# Altium project HITACHI_Wind.PrjPcb
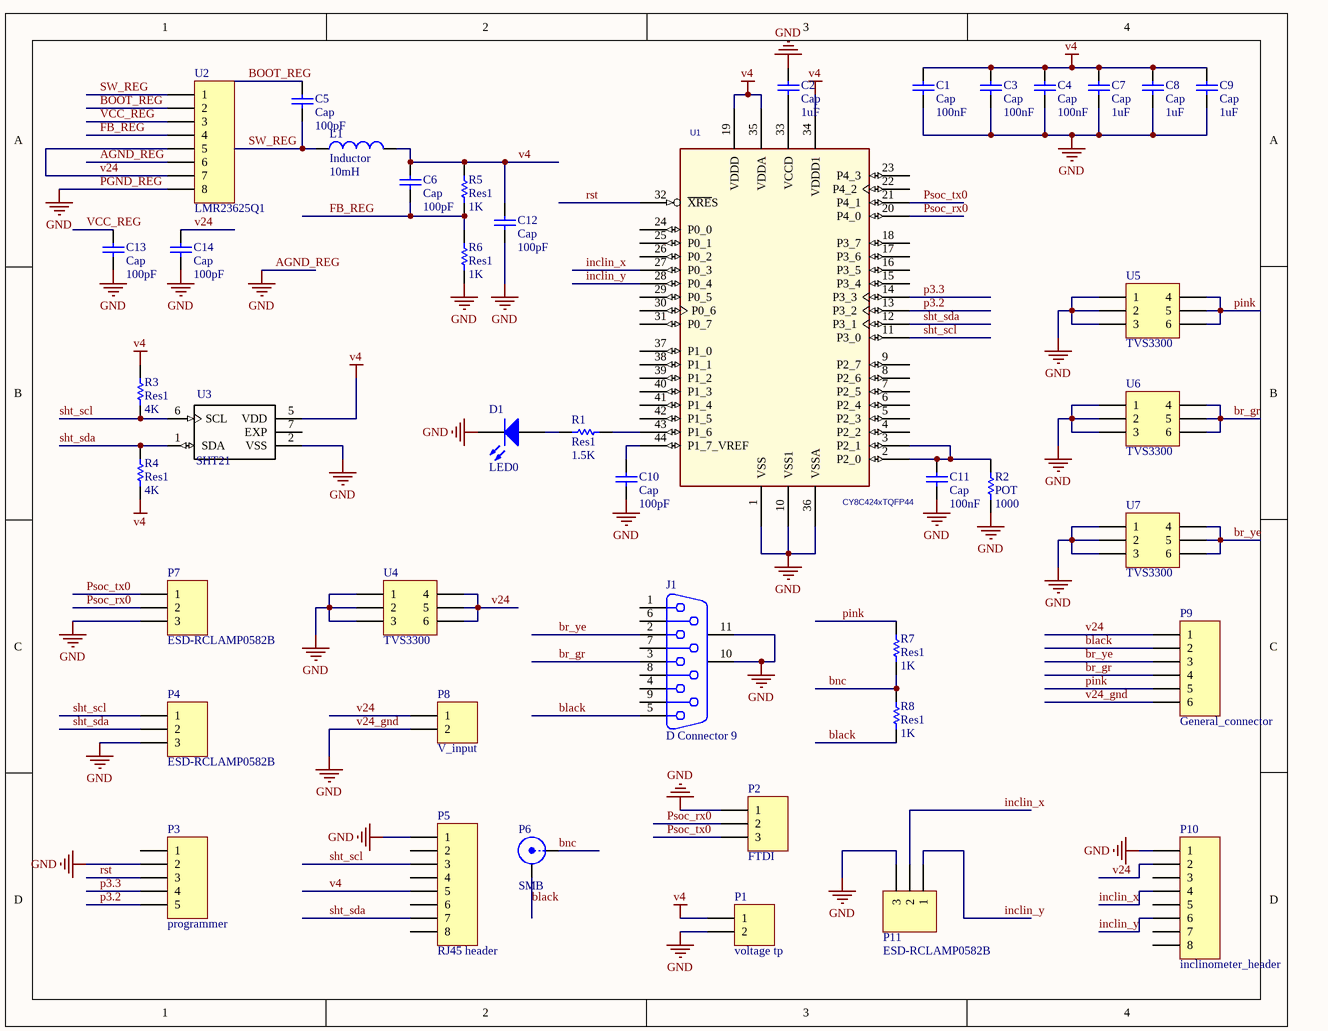
[diagram p0: Hitachi_wind_main.SchDoc]
1 sheet, 43 parts. Net scope: global (net labels, ports and power ports of the same name join across sheets).
Board file: Hitachi_wind_pcb.PcbDoc

## Sheet Hitachi_wind_main.SchDoc: AT long bus (13.3 x 4.2 inches)
size A; Organization: Organization; Address1: Address1; Address2: Address2; Address3: Address3; Address4: Address4; DocumentNumber: 1; Revision: 0; SheetNumber: 2; SheetTotal: 2

### Parts
C1  Cap  value 100nF  [1608[0603]]
C2  Cap  value 1uF  [1608[0603]]
C3  Cap  value 100nF  [1608[0603]]
C4  Cap  value 100nF  [1608[0603]]
C5  Cap  value 100pF  [1608[0603]]
C6  Cap  value 100pF  [1608[0603]]
C7  Cap  value 1uF  [1608[0603]]
C8  Cap  value 1uF  [1608[0603]]
C9  Cap  value 1uF  [1608[0603]]
C10  Cap  value 100pF  [1608[0603]]
C11  Cap  value 100nF  [1608[0603]]
C12  Cap  value 100pF  [1608[0603]]
C13  Cap  value 100pF  [1608[0603]]
C14  Cap  value 100pF  [1608[0603]]
D1  LED0  [3.2X1.6X1.1]
J1  D Connector 9  [DSUB1.385-2H9]
L1  Inductor  value 10mH  [0402-A]
P1  voltage tp  [HDR1X2]
P2  FTDI  [HDR1X3]
P3  programmer  [HDR1X5]
P4  ESD-RCLAMP0582B  [SC75]
P5  RJ45 header  [RJ-45 Header]
P6  SMB  [SMB_V-RJ45]
P7  ESD-RCLAMP0582B  [SC75]
P8  V_input  [HDR1X2]
P9  General_connector  [HDR1X6]
P10  inclinometer_header  [RJ-45 Header]
P11  ESD-RCLAMP0582B  [SC75]
R1  Res1  value 1.5K  [6-0805_M]
R2  POT  value 1000  [6-0805_M]
R3  Res1  value 4K  [6-0805_M]
R4  Res1  value 4K  [6-0805_M]
R5  Res1  value 1K  [6-0805_M]
R6  Res1  value 1K  [6-0805_M]
R7  Res1  value 1K  [6-0805_M]
R8  Res1  value 1K  [6-0805_M]
U1  CY8C424xTQFP44  [TQFP50P900X900X160-48N]
U2  LMR23625Q1  [SOIC-8]
U3  SHT21  [SON100P300X300X110-7N]
U4  TVS3300  [WSON-6_M]
U5  TVS3300  [WSON-6_M]
U6  TVS3300  [WSON-6_M]
U7  TVS3300  [WSON-6_M]

### Nets
AGND_REG: C1.1 C2.2 C3.1 C4.1 C7.1 C8.1 C9.1 C10.1 C11.1 C12.1 C13.1 C14.1 D1.2(K) J1.10(MH1) J1.11(MH2) P1.2 P2.1 P3.2 P4.3 P5.1 P7.3 P8.2 P9.6 P10.1 P11.3 R2.1 R6.1 U1.1(VSS) U1.10(VSS1) U1.36(VSSA) U2.6 U2.8 U3.2(VSS) U4.1 U4.2 U4.3 U5.1 U5.2 U5.3 U6.1 U6.2 U6.3 U7.1 U7.2 U7.3  [also labelled GND, PGND_REG, v24_gnd]
v4: C1.2 C3.2 C4.2 C6.2 C7.2 C8.2 C9.2 C12.2 L1.2 P1.1 P5.5 R3.2 R4.1 R5.2 U1.19(VDDD) U1.34(VDDD1) U1.35(VDDA) U3.5(VDD)
black: J1.5 P6.2(Y) P9.2 R8.1
bnc: P6.1(X) R7.1 R8.2
BOOT_REG: C5.2 U2.2
br_gr: J1.3 P9.4 U6.4 U6.5 U6.6
br_ye: J1.2 P9.3 U7.4 U7.5 U7.6
FB_REG: C6.1 R5.1 R6.2 U2.4
inclin_x: P10.4 P11.2 U1.27(P0_3)
inclin_y: P10.6 P11.1 U1.28(P0_4)
p3.2: P3.5 U1.13(P3_2)
p3.3: P3.4 U1.14(P3_3)
pink: P9.5 R7.2 U5.4 U5.5 U5.6
Psoc_rx0: P2.2 P7.2 U1.20(P4_0)
Psoc_tx0: P2.3 P7.1 U1.21(P4_1)
rst: P3.3 U1.32(~{XRE}S)
sht_scl: P4.1 P5.3 R3.1 U1.11(P3_0) U3.6(SCL)
sht_sda: P4.2 P5.7 R4.2 U1.12(P3_1) U3.1(SDA)
SW_REG: C5.1 L1.1 U2.1
v24: C14.2 P8.1 P9.1 P10.2 U2.5 U2.7 U4.4 U4.5 U4.6
VCC_REG: C13.2 U2.3
NetC2_1: C2.1 U1.33(VCCD)
NetC10_2: C10.2 U1.44(P1_7_VREF)
NetC11_2: C11.2 R2.2 U1.2(P2_0) U1.3(P2_1)
NetD1_1: D1.1(A) R1.1
NetR1_2: R1.2 U1.43(P1_6)

Not connected (* = marked no-connect by the designer): J1 1 4 6 7 8 9; P3 1; P5 2 4 6 8; P10 3 5 7 8; U1 4(P2_2) 5(P2_3) 6(P2_4) 7(P2_5) 8(P2_6) 9(P2_7) 15(P3_4) 16(P3_5) 17(P3_6) 18(P3_7) 22(P4_2) 23(P4_3) 24(P0_0) 25(P0_1) 26(P0_2) 29(P0_5) 30(P0_6) 31(P0_7) 37(P1_0) 38(P1_1) 39(P1_2) 40(P1_3) 41(P1_4) 42(P1_5); U3 7(EXP)

### Library data of the parts
C1-C14 = Cap: Capacitor; Published: 8-Jun-2000; LatestRevisionDate: 17-Jul-2002; LatestRevisionNote: Re-released for DXP Platform.; PackageReference: RAD-0.3; Publisher: Altium Limited; PackageDescription: Radial Cap, Thru-Hole; 2 Leads; 0.3 in Pin Spacing
D1 = LED0: Typical INFRARED GaAs LED; Published: 8-Jun-2000; LatestRevisionDate: 08-Jul-2005; LatestRevisionNote: Mech Layer 1 removed.; PackageReference: LED-0; Publisher: Altium Limited; PackageDescription: LED; 2 Leads
J1 = D Connector 9: Receptacle Assembly, 9 Position, Right Angle; PackageDocument: O; Positions: 9; Published: 15-Jun-2001; LatestRevisionDate: 17-Jul-2002; LatestRevisionNote: Re-released for DXP Platform.; DatasheetDocument: 1-Sep-1999; PackageReference: 788750; Publisher: Altium Limited; Orientation: Right Angle; Gender: Receptacle
L1 = Inductor: Code_IEC: 1005; Published: 8-Jun-2000; LatestRevisionDate: 29-May-2009; LatestRevisionNote: IPC-7351 Footprint Added.; PackageReference: 0402-A; Publisher: Altium Limited; PackageDescription: Chip Inductor; Code_JEITA: 0402
P1 P8 = Header 2: Header, 2-Pin; LatestRevisionDate: 17-Jul-2002; LatestRevisionNote: Re-released for DXP Platform.; Publisher: Altium Limited
P2 = Header 3: Header, 3-Pin; LatestRevisionDate: 17-Jul-2002; LatestRevisionNote: Re-released for DXP Platform.; Publisher: Altium Limited
P3 = Header 5: Header, 5-Pin; LatestRevisionDate: 17-Jul-2002; LatestRevisionNote: Re-released for DXP Platform.; Publisher: Altium Limited
P4 P7 P11 = Header 3: Header, 3-Pin; pin to pad: 1>3 2>1 3>2; LatestRevisionDate: 17-Jul-2002; LatestRevisionNote: Re-released for DXP Platform.; Publisher: Altium Limited
P5 P10 U2 = Header 8: Header, 8-Pin; LatestRevisionDate: 17-Jul-2002; LatestRevisionNote: Re-released for DXP Platform.; Publisher: Altium Limited
P6 = SMB: SMB Straight Connector; LatestRevisionDate: 17-Jul-2002; LatestRevisionNote: Re-released for DXP Platform.; Publisher: Altium Limited
P9 = Header 6: Header, 6-Pin; LatestRevisionDate: 17-Jul-2002; LatestRevisionNote: Re-released for DXP Platform.; Publisher: Altium Limited
R1-R8 = Res1: Resistor; Published: 8-Jun-2000; LatestRevisionDate: 17-Jul-2002; LatestRevisionNote: Re-released for DXP Platform.; PackageReference: AXIAL-0.3; Publisher: Altium Limited; PackageDescription: Axial Device, Thru-Hole; 2 Leads; 0.3 in Pin Spacing
U1 = CY8C424xTQFP44: Part Number: CY8C424xTQFP44*
U3 = SHT21: SHT21 Series 3 V -40 to +125 Â°C Digital Humidity & Temperature Sensor IC - DFN-6; MF: Sensirion; Package: DFN-6 Sensirion; Price: 4.63 USD; MP: SHT21; Availability: Good; SnapEDA_Link: https://www.snapeda.com/parts/SHT21/Sensirion/view-part/?ref=snap; Value: *
U4-U7 = Header 3X2A: Header, 3-Pin, Dual row; LatestRevisionDate: 17-Jul-2002; LatestRevisionNote: Re-released for DXP Platform.; Publisher: Altium Limited